# Altium schematic sheet ParallelReadDecode.SchDoc
size B; PageSetup: Record=PageOptions|CenterHorizontal=True|CenterVertical=True|PrintScale=1.09|XCorrection=1.00|YCorrection=1.00|PrintKind=0|BorderSize=5000000|LeftOffset=0|BottomOffset=0|Orientation=2|PaperLength=1000|PaperWidth=1000|Scale=100|PaperSource=7|PrintQuality=-4|MediaType=1|DitherType=10|PaperKind=Tabloid 11 x 17in|PrintScaleMode=1
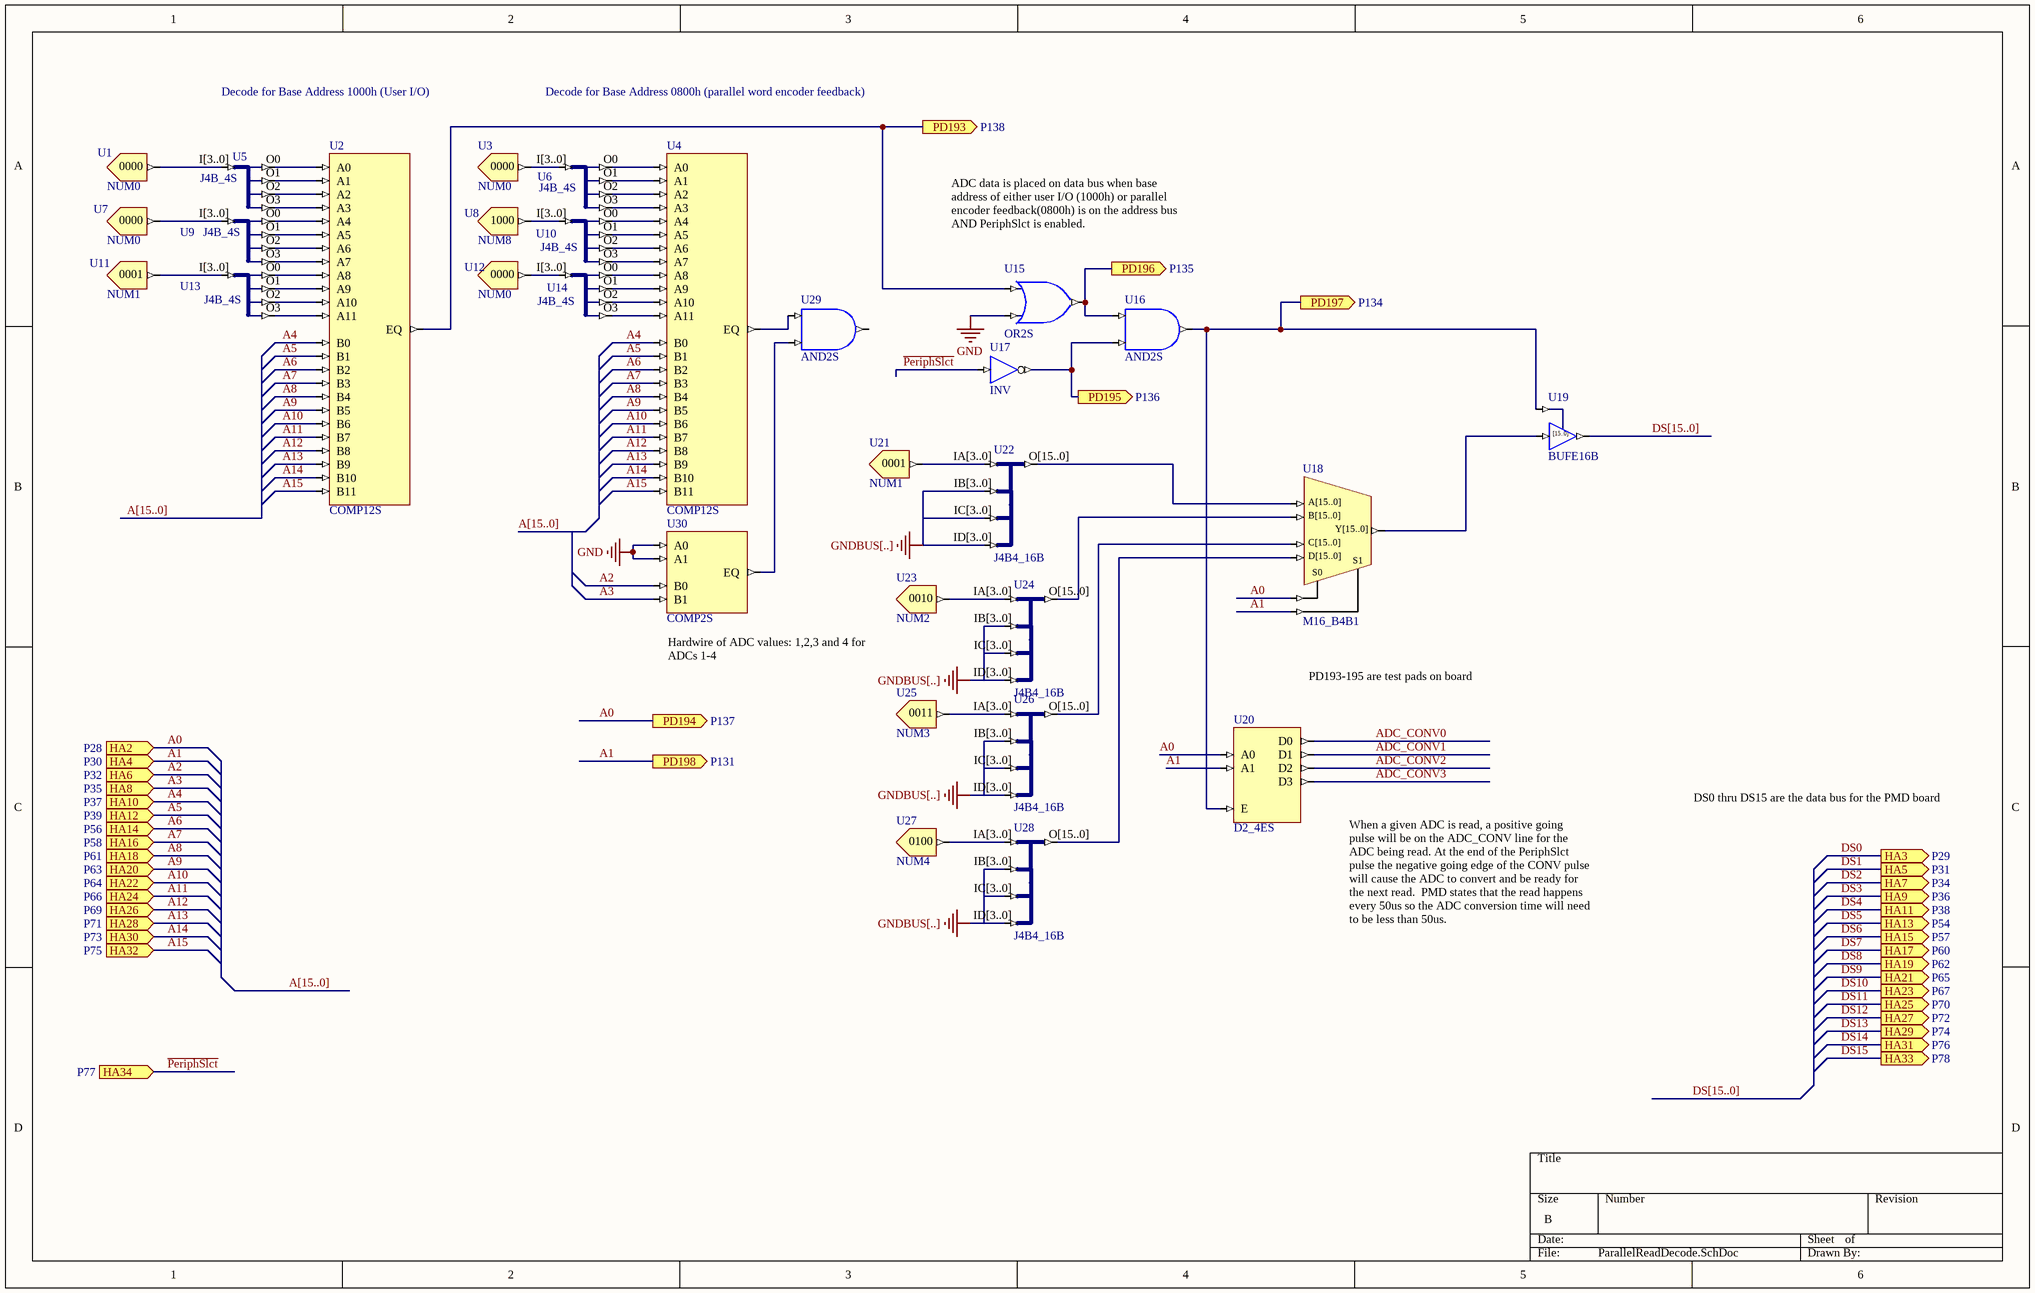
[diagram p0: ParallelReadDecode.SchDoc]

## Parts
U1  NUM0
U2  COMP12S
U3  NUM0
U4  COMP12S
U5  J4B_4S
U6  J4B_4S
U7  NUM0
U8  NUM8
U9  J4B_4S
U10  J4B_4S
U11  NUM1
U12  NUM0
U13  J4B_4S
U14  J4B_4S
U15  OR2S
U16  AND2S
U17  INV
U18  M16_B4B1
U19  BUFE16B
U20  D2_4ES
U21  NUM1
U22  J4B4_16B
U23  NUM2
U24  J4B4_16B
U25  NUM3
U26  J4B4_16B
U27  NUM4
U28  J4B4_16B
U29  AND2S
U30  COMP2S

## Ports
HA2 (in, see P28), HA3 (out, see P29), HA4 (in, see P30), HA5 (out, see P31), HA6 (in, see P32), HA7 (out, see P34), HA8 (in, see P35), HA9 (out, see P36), HA10 (in, see P37), HA11 (out, see P38), HA12 (in, see P39), HA13 (out, see P54), HA14 (in, see P56), HA15 (out, see P57), HA16 (in, see P58), HA17 (out, see P60), HA18 (in, see P61), HA19 (out, see P62), HA20 (in, see P63), HA21 (out, see P65), HA22 (in, see P64), HA23 (out, see P67), HA24 (in, see P66), HA25 (out, see P70), HA26 (in, see P69), HA27 (out, see P72), HA28 (in, see P71), HA29 (out, see P74), HA30 (in, see P73), HA31 (out, see P76), HA32 (in, see P75), HA33 (out, see P78), HA34 (in, see P77), PD193 (out, see P138), PD194 (out, see P137), PD195 (out, see P136), PD196 (out, see P135), PD197 (out, see P134), PD198 (out, see P131)

## Nets
GND: U15.I1 U30.A0 U30.A1
GNDBUS[..]: U22.IB[3..0] U22.IC[3..0] U22.ID[3..0] U24.IB[3..0] U24.IC[3..0] U24.ID[3..0] U26.IB[3..0] U26.IC[3..0] U26.ID[3..0] U28.IB[3..0] U28.IC[3..0] U28.ID[3..0]
~{PeriphSlct}: U17.I ; port HA34
A0: U18.S0 U20.A0 ; port HA2, port PD194
A1: U18.S1 U20.A1 ; port HA4, port PD198
A2: U30.B0 ; port HA6
A3: U30.B1 ; port HA8
A4: U2.B0 U4.B0 ; port HA10
A5: U2.B1 U4.B1 ; port HA12
A6: U2.B2 U4.B2 ; port HA14
A7: U2.B3 U4.B3 ; port HA16
A8: U2.B4 U4.B4 ; port HA18
A9: U2.B5 U4.B5 ; port HA20
A10: U2.B6 U4.B6 ; port HA22
A11: U2.B7 U4.B7 ; port HA24
A12: U2.B8 U4.B8 ; port HA26
A13: U2.B9 U4.B9 ; port HA28
A14: U2.B10 U4.B10 ; port HA30
A15: U2.B11 U4.B11 ; port HA32
ADC_CONV0: U20.D0
ADC_CONV1: U20.D1
ADC_CONV2: U20.D2
ADC_CONV3: U20.D3
DS0: port HA3
DS1: port HA5
DS2: port HA7
DS3: port HA9
DS4: port HA11
DS5: port HA13
DS6: port HA15
DS7: port HA17
DS8: port HA19
DS9: port HA21
DS10: port HA23
DS11: port HA25
DS12: port HA27
DS13: port HA29
DS14: port HA31
DS15: port HA33
DS[15..0]: U19.O[15..0]
PD193: U2.EQ U15.I0 ; port PD193
PD195: U16.I1 U17.O ; port PD195
PD196: U15.O U16.I0 ; port PD196
PD197: U16.O U19.E U20.E ; port PD197
NetU1_O[3..0]: U1.O[3..0] U5.I[3..0]
NetU2_A0: U2.A0 U5.O0
NetU2_A1: U2.A1 U5.O1
NetU2_A2: U2.A2 U5.O2
NetU2_A3: U2.A3 U5.O3
NetU2_A4: U2.A4 U9.O0
NetU2_A5: U2.A5 U9.O1
NetU2_A6: U2.A6 U9.O2
NetU2_A7: U2.A7 U9.O3
NetU2_A8: U2.A8 U13.O0
NetU2_A9: U2.A9 U13.O1
NetU2_A10: U2.A10 U13.O2
NetU2_A11: U2.A11 U13.O3
NetU3_O[3..0]: U3.O[3..0] U6.I[3..0]
NetU4_A0: U4.A0 U6.O0
NetU4_A1: U4.A1 U6.O1
NetU4_A2: U4.A2 U6.O2
NetU4_A3: U4.A3 U6.O3
NetU4_A4: U4.A4 U10.O0
NetU4_A5: U4.A5 U10.O1
NetU4_A6: U4.A6 U10.O2
NetU4_A7: U4.A7 U10.O3
NetU4_A8: U4.A8 U14.O0
NetU4_A9: U4.A9 U14.O1
NetU4_A10: U4.A10 U14.O2
NetU4_A11: U4.A11 U14.O3
NetU4_EQ: U4.EQ U29.I0
NetU7_O[3..0]: U7.O[3..0] U9.I[3..0]
NetU8_O[3..0]: U8.O[3..0] U10.I[3..0]
NetU11_O[3..0]: U11.O[3..0] U13.I[3..0]
NetU12_O[3..0]: U12.O[3..0] U14.I[3..0]
NetU18_A[15..0]: U18.A[15..0] U22.O[15..0]
NetU18_B[15..0]: U18.B[15..0] U24.O[15..0]
NetU18_C[15..0]: U18.C[15..0] U26.O[15..0]
NetU18_D[15..0]: U18.D[15..0] U28.O[15..0]
NetU18_Y[15..0]: U18.Y[15..0] U19.I[15..0]
NetU21_O[3..0]: U21.O[3..0] U22.IA[3..0]
NetU23_O[3..0]: U23.O[3..0] U24.IA[3..0]
NetU25_O[3..0]: U25.O[3..0] U26.IA[3..0]
NetU27_O[3..0]: U27.O[3..0] U28.IA[3..0]
NetU29_I1: U29.I1 U30.EQ

Not connected (* = marked no-connect by the designer): U29 O

## Buses and harness runs
bus A[15..0]
bus DS[15..0]

## Notes on the sheet
- Decode for Base Address 1000h (User I/O)
- Decode for Base Address 0800h (parallel word encoder feedback)
- ADC data is placed on data bus when base address of either user I/O (1000h) or parallel encoder feedback(0800h) is on the address bus AND PeriphSlct is enabled.
- (near U30) Hardwire of ADC values: 1,2,3 and 4 for ADCs 1-4
- PD193-195 are test pads on board
- DS0 thru DS15 are the data bus for the PMD board
- (near U20) When a given ADC is read, a positive going pulse will be on the ADC_CONV line for the ADC being read. At the end of the PeriphSlct pulse the negative going edge of the CONV pulse will cause the ADC to convert and be ready for the next read.  PMD states that the read happens every 50us so the ADC conversion time will need to be less than 50us.
- (in symbol BUFE16B) [15..0]
- (in symbol NUM0) 0000
- (in symbol NUM1) 0001
- (in symbol NUM2) 0010
- (in symbol NUM3) 0011
- (in symbol NUM4) 0100
- (in symbol NUM8) 1000

## Library data of the parts
U1 U3 U7 U12 = NUM0: Number Connector 0; FunctionalClass: Numeric Connector; SubClass: 0; PortSize: 4; PortStyle: Bus Version; ArchiveName: GENERIC; VHDLIB_SIM: GENERIC_LIB; Published: 29-Jan-2004; Publisher: Altium Limited; LastRevisionNo: 1.00.00; HelpURL: CR0118 FPGA Generic Library Guide.pdf#page=409; ComponentLink1URL: CR0138 FPGA Numeric Connector Resource Usage.pdf#page=2; ComponentLink1Description: Core &Resource Usage
U2 U4 = COMP12S: 12-Bit Identity Comparator, Single Pin Version; SubClass: COMP; PortSize: 12; ArchiveName: GENERIC; VHDLIB_SIM: GENERIC_LIB; Published: 29-Jan-2004; Publisher: Altium Limited; LastRevisionNo: 1.00.00; HelpURL: CR0118 FPGA Generic Library Guide.pdf#page=151; ComponentLink1URL: CR0129 FPGA Comparator Resource Usage.pdf#page=21; ComponentLink1Description: Core &Resource Usage; FunctionalClass: Comparator; PortStyle: Single Pin Version
U5 U6 U9 U10 U13 U14 = J4B_4S: 4-Bit input bus to 4 Single pin outputs; FunctionalClass: Bus Joiner; PortSize: 4; ArchiveName: GENERIC; VHDLIB_SIM: GENERIC_LIB; Published: 29-Jan-2004; Publisher: Altium Limited; LastRevisionNo: 1.00.00; HelpURL: CR0118 FPGA Generic Library Guide.pdf#page=304; ComponentLink1URL: CR0126 FPGA Bus Joiner Resource Usage.pdf#page=11; ComponentLink1Description: Core &Resource Usage
U8 = NUM8: Number Connector 8; FunctionalClass: Numeric Connector; SubClass: 8; PortSize: 4; PortStyle: Bus Version; ArchiveName: GENERIC; VHDLIB_SIM: GENERIC_LIB; Published: 29-Jan-2004; Publisher: Altium Limited; LastRevisionNo: 1.00.00; HelpURL: CR0118 FPGA Generic Library Guide.pdf#page=409; ComponentLink1URL: CR0138 FPGA Numeric Connector Resource Usage.pdf#page=10; ComponentLink1Description: Core &Resource Usage
U11 U21 = NUM1: Number Connector 1; FunctionalClass: Numeric Connector; SubClass: 1; PortSize: 4; PortStyle: Bus Version; ArchiveName: GENERIC; VHDLIB_SIM: GENERIC_LIB; Published: 29-Jan-2004; Publisher: Altium Limited; LastRevisionNo: 1.00.00; HelpURL: CR0118 FPGA Generic Library Guide.pdf#page=409; ComponentLink1URL: CR0138 FPGA Numeric Connector Resource Usage.pdf#page=3; ComponentLink1Description: Core &Resource Usage
U15 = OR2S: 2-Input OR Gate, Single Pin Version; XilinxEquivalent: OR2; FunctionalClass: Logic Primitive; PortSize: 2; ArchiveName: GENERIC; VHDLIB_SIM: GENERIC_LIB; Published: 29-Jan-2004; Publisher: Altium Limited; LastRevisionNo: 1.00.00; HelpURL: CR0118 FPGA Generic Library Guide.pdf#page=410; ComponentLink1URL: CR0136 FPGA Logic Primitive Resource Usage.pdf#page=190; ComponentLink1Description: Core &Resource Usage; SubClass: OR; PortStyle: Single Pin Version
U16 U29 = AND2S: 2-Input AND Gate, Single Pin Version; XilinxEquivalent: AND2; FunctionalClass: Logic Primitive; PortSize: 2; ArchiveName: GENERIC; VHDLIB_SIM: GENERIC_LIB; Published: 29-Jan-2004; Publisher: Altium Limited; LastRevisionNo: 1.00.00; HelpURL: CR0118 FPGA Generic Library Guide.pdf#page=114; ComponentLink1URL: CR0136 FPGA Logic Primitive Resource Usage.pdf#page=13; ComponentLink1Description: Core &Resource Usage; SubClass: AND; PortStyle: Single Pin Version
U17 = INV: Inverter; FunctionalClass: Logic Primitive; ArchiveName: GENERIC; VHDLIB_SIM: GENERIC_LIB; Published: 29-Jan-2004; Publisher: Altium Limited; XilinxEquivalent: INV; LastRevisionNo: 1.00.00; HelpURL: CR0118 FPGA Generic Library Guide.pdf#page=291; ComponentLink1URL: CR0136 FPGA Logic Primitive Resource Usage.pdf#page=61; ComponentLink1Description: Core &Resource Usage; SubClass: INV
U18 = M16_B4B1: 4x16-Bit Bus to 1x16-Bit Bus Multiplexer; SubClass: BnB1; PortSize: 16; ArchiveName: GENERIC; VHDLIB_SIM: GENERIC_LIB; Published: 29-Jan-2004; Publisher: Altium Limited; LastRevisionNo: 1.00.00; HelpURL: CR0118 FPGA Generic Library Guide.pdf#page=370; ComponentLink1URL: CR0137 FPGA Multiplexer Resource Usage.pdf#page=420; ComponentLink1Description: Core &Resource Usage; FunctionalClass: Multiplexer
U19 = BUFE16B: 16-Bit 3-state Buffer with Active High Enable, Bus Version; XilinxEquivalent: BUFE16; SubClass: BUFE; PortSize: 16; ArchiveName: GENERIC; VHDLIB_SIM: GENERIC_LIB; Published: 29-Jan-2004; Publisher: Altium Limited; LastRevisionNo: 1.00.00; HelpURL: CR0118 FPGA Generic Library Guide.pdf#page=124; ComponentLink1URL: CR0125 FPGA Buffer Resource Usage.pdf#page=49; ComponentLink1Description: Core &Resource Usage; FunctionalClass: Buffer; Enable: High; PortStyle: Bus Version
U20 = D2_4ES: Binary 2- to 4-Bit Decoder with Enable, Single Pin Version; XilinxEquivalent: D2_4E; SubClass: n_m; Enable: High; PortSize: 4; ArchiveName: GENERIC; VHDLIB_SIM: GENERIC_LIB; Published: 29-Jan-2004; Publisher: Altium Limited; LastRevisionNo: 1.00.00; HelpURL: CR0118 FPGA Generic Library Guide.pdf#page=159; ComponentLink1URL: CR0131 FPGA Decoder Resource Usage.pdf#page=4; ComponentLink1Description: Core &Resource Usage; FunctionalClass: Decoder; PortStyle: Single Pin Version
U22 U24 U26 U28 = J4B4_16B: 4 x 4-Bit input bus to 1 x 16-bit output bus; FunctionalClass: Bus Joiner; PortSize: 4; ArchiveName: GENERIC; VHDLIB_SIM: GENERIC_LIB; Published: 29-Jan-2004; Publisher: Altium Limited; LastRevisionNo: 1.00.00; HelpURL: CR0118 FPGA Generic Library Guide.pdf#page=302; ComponentLink1URL: CR0126 FPGA Bus Joiner Resource Usage.pdf#page=7; ComponentLink1Description: Core &Resource Usage
U23 = NUM2: Number Connector 2; FunctionalClass: Numeric Connector; SubClass: 2; PortSize: 4; PortStyle: Bus Version; ArchiveName: GENERIC; VHDLIB_SIM: GENERIC_LIB; Published: 29-Jan-2004; Publisher: Altium Limited; LastRevisionNo: 1.00.00; HelpURL: CR0118 FPGA Generic Library Guide.pdf#page=409; ComponentLink1URL: CR0138 FPGA Numeric Connector Resource Usage.pdf#page=4; ComponentLink1Description: Core &Resource Usage
U25 = NUM3: Number Connector 3; FunctionalClass: Numeric Connector; SubClass: 3; PortSize: 4; PortStyle: Bus Version; ArchiveName: GENERIC; VHDLIB_SIM: GENERIC_LIB; Published: 29-Jan-2004; Publisher: Altium Limited; LastRevisionNo: 1.00.00; HelpURL: CR0118 FPGA Generic Library Guide.pdf#page=409; ComponentLink1URL: CR0138 FPGA Numeric Connector Resource Usage.pdf#page=5; ComponentLink1Description: Core &Resource Usage
U27 = NUM4: Number Connector 4; FunctionalClass: Numeric Connector; SubClass: 4; PortStyle: Bus Version; ArchiveName: GENERIC; VHDLIB_SIM: GENERIC_LIB; Published: 29-Jan-2004; Publisher: Altium Limited; LastRevisionNo: 1.00.00; HelpURL: CR0118 FPGA Generic Library Guide.pdf#page=409; ComponentLink1URL: CR0138 FPGA Numeric Connector Resource Usage.pdf#page=6; ComponentLink1Description: Core &Resource Usage; PortSize: 4
U30 = COMP2S: 2-Bit Identity Comparator, Single Pin Version; XilinxEquivalent: COMP2; SubClass: COMP; PortSize: 2; ArchiveName: GENERIC; VHDLIB_SIM: GENERIC_LIB; Published: 29-Jan-2004; Publisher: Altium Limited; LastRevisionNo: 1.00.00; HelpURL: CR0118 FPGA Generic Library Guide.pdf#page=151; ComponentLink1URL: CR0129 FPGA Comparator Resource Usage.pdf#page=3; ComponentLink1Description: Core &Resource Usage; FunctionalClass: Comparator; PortStyle: Single Pin Version